# EAGLE schematic EEZ Arduino shield+BP r3B3 (EAGLE 6.1)
Assembly variants: Farnell, TME

## Sheet 1 of 5
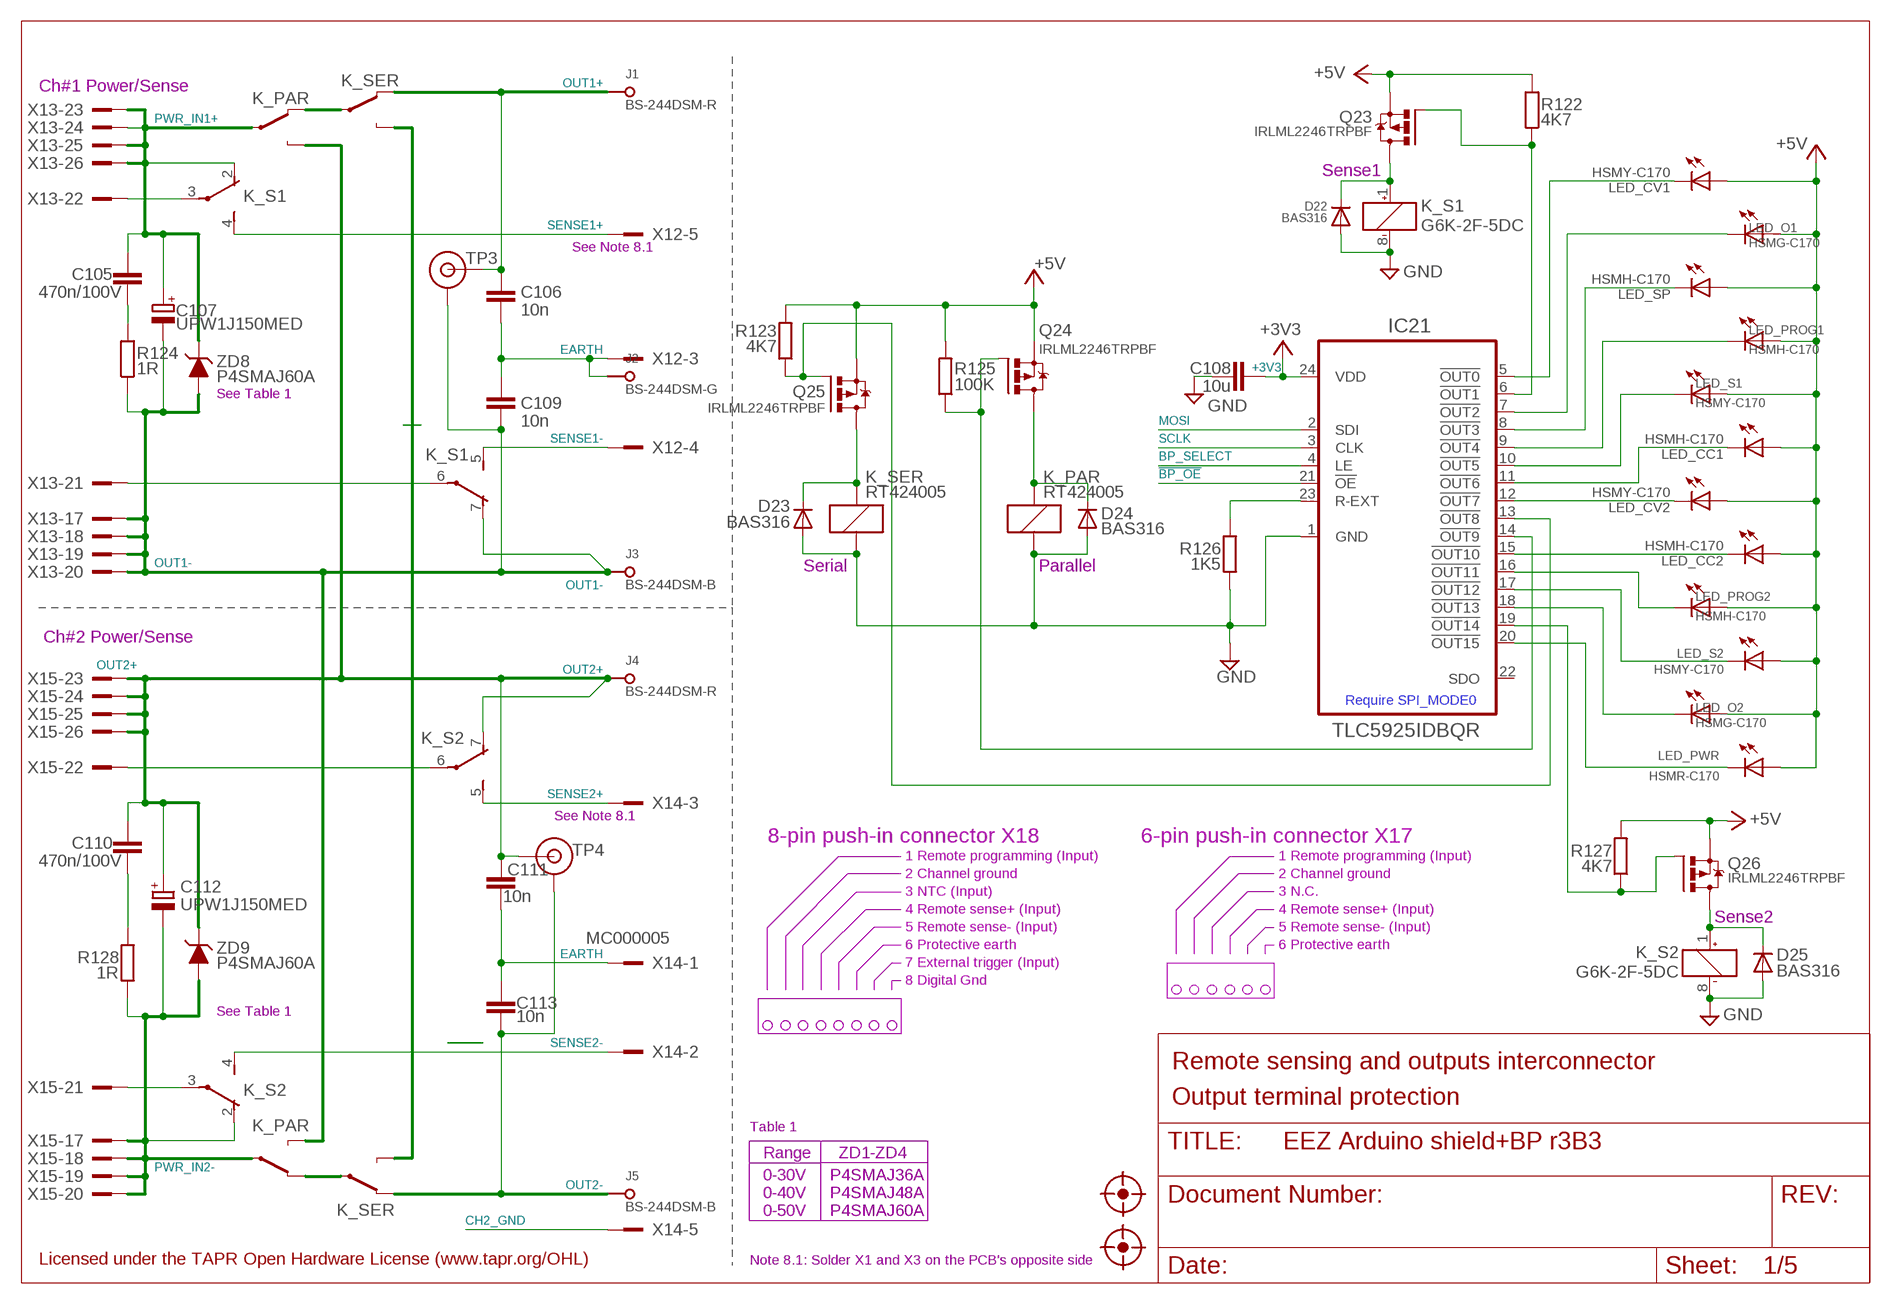
[diagram p0: schematic, sheet 1]

### Parts
C105  470n/100V  C-EUC1812  [C1812]
C106  10n  C-EUC1206  [C1206]
C107  UPW1J150MED  ECAPEEEFK+2.5MM  [CAPAE660X610N_COMBO2]
C108  10u  C-EUC1206  [C1206]
C109  10n  C-EUC1206  [C1206]
C110  470n/100V  C-EUC1812  [C1812]
C111  10n  C-EUC1206  [C1206]
C112  UPW1J150MED  ECAPEEEFK+2.5MM  [CAPAE660X610N_COMBO2]
C113  10n  C-EUC1206  [C1206]
D22  BAS316  DIODE-SOD323-W  [SOD323-W]
D23  BAS316  DIODE-SOD323-W  [SOD323-W]
D24  BAS316  DIODE-SOD323-W  [SOD323-W]
D25  BAS316  DIODE-SOD323-W  [SOD323-W]
IC21  TLC5925IDBQR  [SOP63P600X175-24N]
J1  BS-244DSM-R  BINDING_POST-2  [BP_5_12]
J2  BS-244DSM-G  BINDING_POST-2  [BP_5_12]
J3  BS-244DSM-B  BINDING_POST-2  [BP_5_12]
J4  BS-244DSM-R  BINDING_POST-2  [BP_5_12]
J5  BS-244DSM-B  BINDING_POST-2  [BP_5_12]
K_PAR  RT424005  RELAY_RT314012-2  [RT-C/016A5_ROUND]
K_S1  G6K-2F-5DC  G6K-2F  [G6K-2F]
K_S2  G6K-2F-5DC  G6K-2F  [G6K-2F]
K_SER  RT424005  RELAY_RT314012-2  [RT-C/016A5_ROUND]
LED_CC1  HSMH-C170  LED0805  [LED_0805]
LED_CC2  HSMH-C170  LED0805  [LED_0805]
LED_CV1  HSMY-C170  LED0805  [LED_0805]
LED_CV2  HSMY-C170  LED0805  [LED_0805]
LED_O1  HSMG-C170  LED0805  [LED_0805]
LED_O2  HSMG-C170  LED0805  [LED_0805]
LED_PROG1  HSMH-C170  LED0805  [LED_0805]
LED_PROG2  HSMH-C170  LED0805  [LED_0805]
LED_PWR  HSMR-C170  LED0805  [LED_0805]
LED_S1  HSMY-C170  LED0805  [LED_0805]
LED_S2  HSMY-C170  LED0805  [LED_0805]
LED_SP  HSMH-C170  LED0805  [LED_0805]
Q23  IRLML2246TRPBF  [SOT95P237X112-3N]
Q24  IRLML2246TRPBF  [SOT95P237X112-3N]
Q25  IRLML2246TRPBF  [SOT95P237X112-3N]
Q26  IRLML2246TRPBF  [SOT95P237X112-3N]
R122  4K7  R-EU_R0805  [R0805]
R123  4K7  R-EU_R0805  [R0805]
R124  1R  R-EU_R0805  [R0805]
R125  100K  R-EU_R0805  [R0805]
R126  1K5  R-EU_R0805  [R0805]
R127  4K7  R-EU_R0805  [R0805]
R128  1R  R-EU_R0805  [R0805]
TP3  TEST_POINT  [TP_1.1MM]
TP4  TEST_POINT  [TP_1.1MM]
U$15  FIDUCIAL_2  [FIDUCIAL_DUAL]
U$16  FIDUCIAL_2  [FIDUCIAL_DUAL]
X12  MC000006  MC000006MIRROR  [MC000006_MIRROR]
X13  TSW-113-07-F-D  [TSW-113-07-F-D]
X14  MC000005  MC000005MIRROR  [MC000005_MIRROR]
X15  TSW-113-07-F-D  [TSW-113-07-F-D]
ZD8  P4SMAJ60A  PSMAXX  [DO214AC]
ZD9  P4SMAJ60A  PSMAXX  [DO214AC]

### Nets
!BP_OE: IC21.21(!OE) ; also sheet 2
!BP_OUT0: IC21.5(!OUT0) LED_CV1.C
!BP_OUT1: IC21.6(!OUT1) Q23.1(G) R122.1
!BP_OUT2: IC21.7(!OUT2) LED_O1.C
!BP_OUT3: IC21.8(!OUT3) LED_SP.C
!BP_OUT4: IC21.9(!OUT4) LED_PROG1.C
!BP_OUT5: IC21.10(!OUT5) LED_S1.C
!BP_OUT6: IC21.11(!OUT6) LED_CC1.C
!BP_OUT7: IC21.12(!OUT7) LED_CV2.C
!BP_OUT8: IC21.13(!OUT8) Q25.1(G) R123.1
!BP_OUT9: IC21.14(!OUT9) Q24.1(G) R125.1
!BP_OUT10: IC21.15(!OUT10) LED_CC2.C
!BP_OUT12: IC21.17(!OUT12) LED_S2.C
!BP_OUT13: IC21.18(!OUT13) LED_O2.C
!BP_OUT14: IC21.19(!OUT14) Q26.1(G) R127.1
!BP_OUT15: IC21.20(!OUT15) LED_PWR.C
+3V3: C108.1 IC21.24(VDD) ; also sheet 2,3,4,5
+5V: LED_CC1.A LED_CC2.A LED_CV1.A LED_CV2.A LED_O1.A LED_O2.A LED_PROG1.A LED_PROG2.A LED_PWR.A LED_S1.A LED_S2.A LED_SP.A Q23.2(S) Q24.2(S) Q25.2(S) Q26.2(S) R122.2 R123.2 R125.2 R127.2 ; also sheet 2,3,4,5
BP_SELECT: IC21.4(LE) ; also sheet 2
CH2_GND: X14.5 X14.5.1 ; also sheet 2,4
EARTH: C106.2 C109.1 C111.2 C113.1 J2.P$1 X12.3 X12.3.1 X14.1 X14.1.1 ; also sheet 3
GND [gnd]: C108.2 D22.A D23.A D24.A D25.A IC21.1(GND) K_PAR.A1(K:C2) K_S1.8(1:-) K_S2.8(1:-) K_SER.A1(K:C2) R126.1 ; also sheet 2,3,4,5
MOSI: IC21.2(SDI) ; also sheet 2,3,5
N$92: D22.C K_S1.1(1:+) Q23.3(D)
N$93: D25.C K_S2.1(1:+) Q26.3(D)
N$94: C105.2 R124.2
N$95: C110.2 R128.2
N$96: IC21.16(!OUT11) LED_PROG2.C
N$97: K_SER.14A(-1:O) K_SER.14B(-2:O)
N$98: K_PAR.12A(-1:S) K_SER.11B(-2:P)
N$99: K_PAR.12B(-2:S) K_SER.11A(-1:P)
N$155: D23.C K_SER.A2(K:C1) Q25.3(D)
N$156: D24.C K_PAR.A2(K:C1) Q24.3(D)
N$306: IC21.23(R-EXT) R126.2
OUT1+: C106.1 J1.P$1 K_SER.12B(-2:S) TP3.TIP
OUT1-: C107.2(-) C107.2.1(-) C109.2 J3.P$1 K_PAR.14B(-2:O) K_S1.7(3:O) R124.1 TP3.GND X13.17 X13.18 X13.19 X13.20 ZD8.A
OUT2+: C110.1 C111.1 C112.1(+) C112.1.1(+) J4.P$1 K_PAR.14A(-1:O) K_S2.7(3:O) TP4.TIP X15.23 X15.24 X15.25 X15.26 ZD9.C
OUT2-: C113.2 J5.P$1 K_SER.12A(-1:S) TP4.GND
PWR_IN1+: C105.1 C107.1(+) C107.1.1(+) K_PAR.11A(-1:P) K_S1.2(2:O) X13.23 X13.24 X13.25 X13.26 ZD8.C
PWR_IN2-: C112.2(-) C112.2.1(-) K_PAR.11B(-2:P) K_S2.2(2:O) R128.1 X15.17 X15.18 X15.19 X15.20 ZD9.A
SCLK: IC21.3(CLK) ; also sheet 2,3,5
SENSE1+: K_S1.4(2:S) X12.5 X12.5.1
SENSE1-: K_S1.5(3:S) X12.4 X12.4.1
SENSE1_IN+: K_S1.3(2:P) X13.22
SENSE1_IN-: K_S1.6(3:P) X13.21
SENSE2+: K_S2.5(3:S) X14.3 X14.3.1
SENSE2-: K_S2.4(2:S) X14.2 X14.2.1
SENSE2_IN+: K_S2.6(3:P) X15.22
SENSE2_IN-: K_S2.3(2:P) X15.21
Unconnected: IC21.22(SDO) X14.4 X14.4.1

### Notes on the sheet
- Ch#1 Power/Sense
- Sense1
- See Note 8.1
- See Table 1
- Serial | Parallel
- Ch#2 Power/Sense
- Require SPI_MODE0
- See Note 8.1
- 8-pin push-in connector X18 | 6-pin push-in connector X17
- 1 Remote programming (Input) | 1 Remote programming (Input)
- 2 Channel ground | 2 Channel ground
- 3 NTC (Input) | 3 N.C.
- 4 Remote sense+ (Input) | 4 Remote sense+ (Input)
- Sense2
- 5 Remote sense- (Input) | 5 Remote sense- (Input)
- 6 Protective earth | 6 Protective earth
- 7 External trigger (Input)
- 8 Digital Gnd
- See Table 1
- Remote sensing and outputs interconnector
- Output terminal protection
- Table 1
- Range | ZD1-ZD4
- 0-30V | P4SMAJ36A
- 0-40V | P4SMAJ48A
- 0-50V | P4SMAJ60A
- Licensed under the TAPR Open Hardware License (www.tapr.org/OHL) | Note 8.1: Solder X1 and X3 on the PCB's opposite side

## Sheet 2 of 5
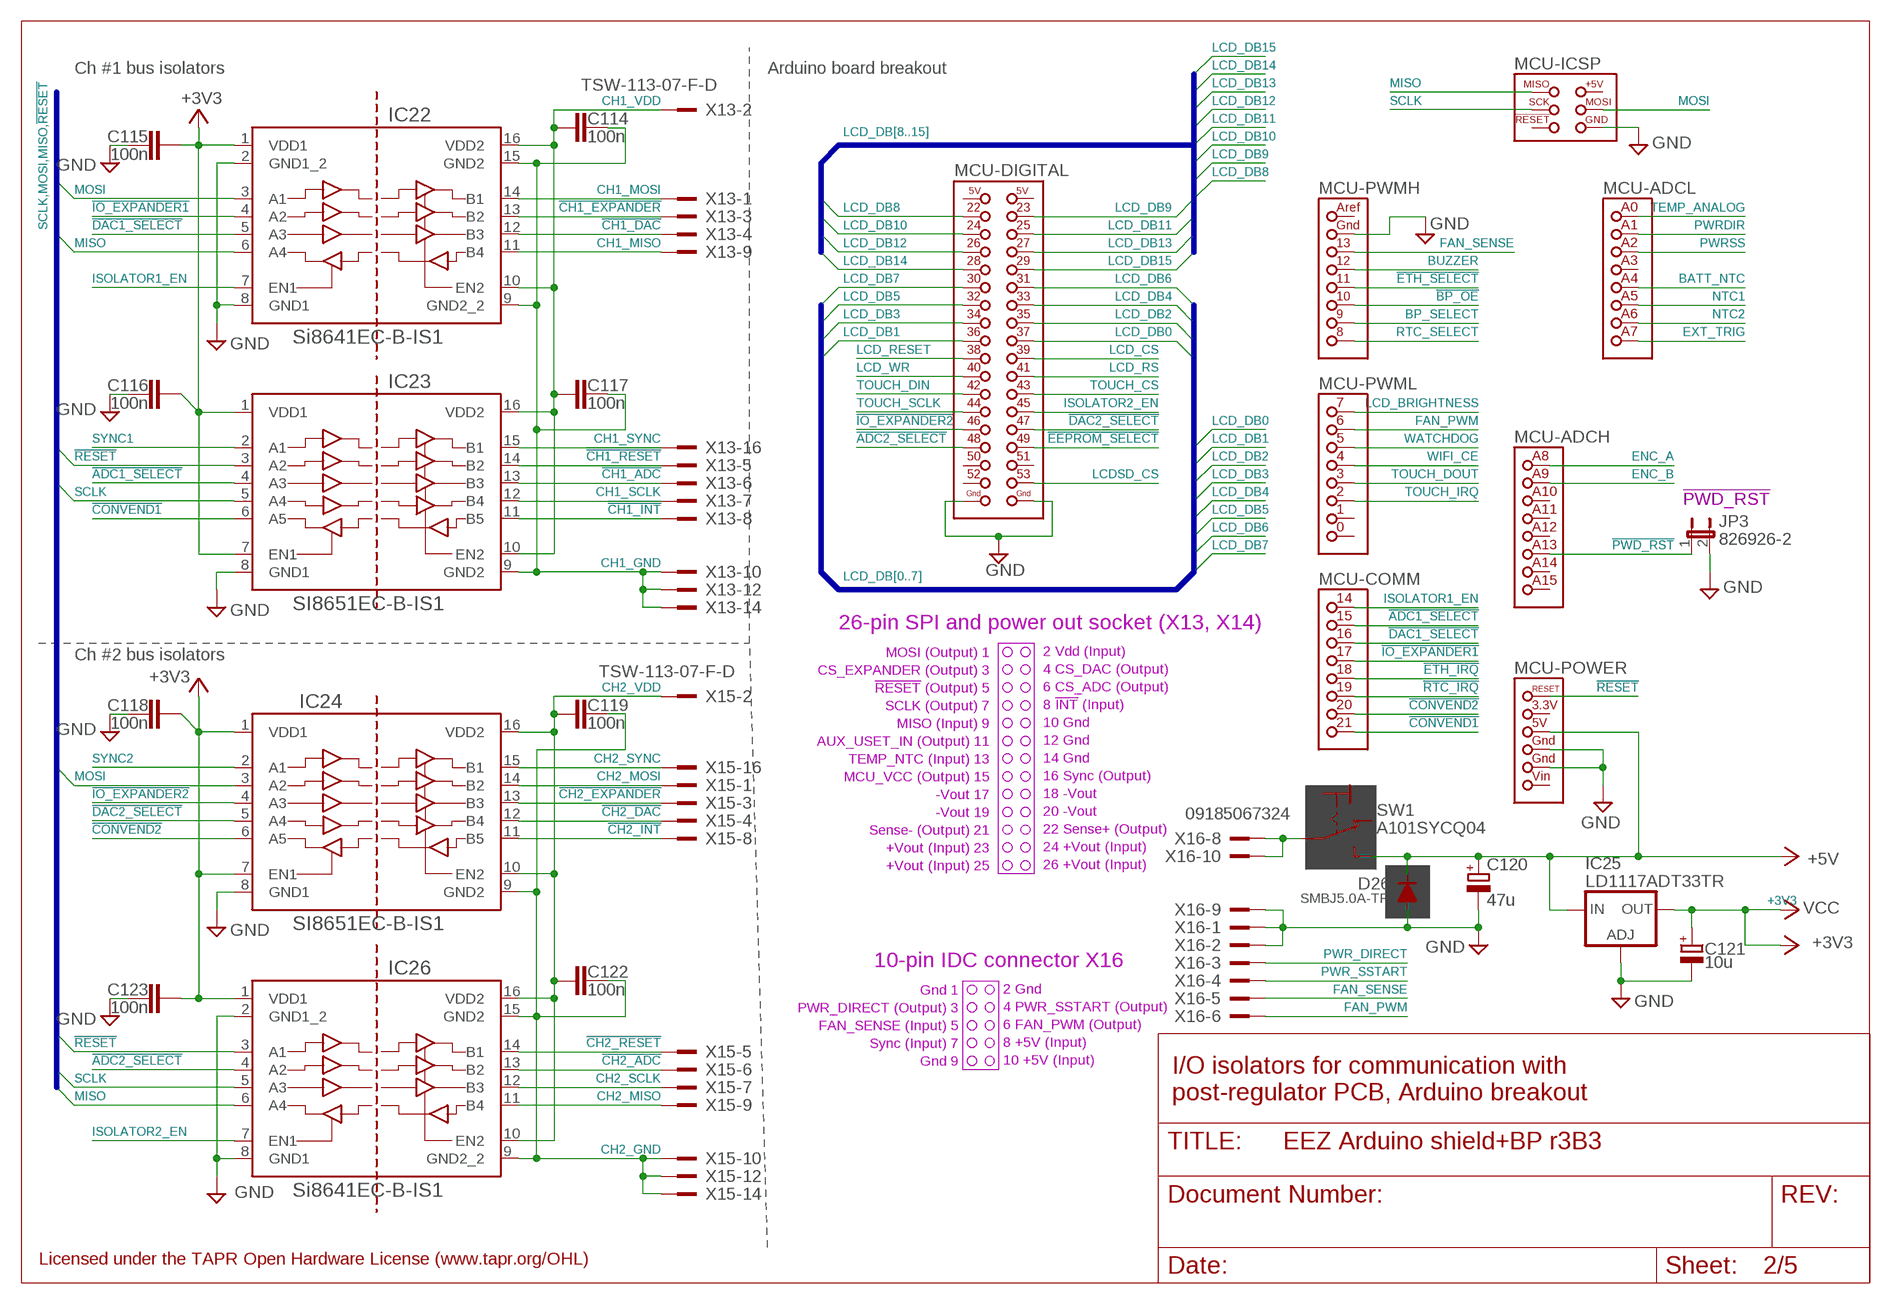
[diagram p1: schematic, sheet 2]

### Parts
C114  100n  C-EUC0603  [C0603]
C115  100n  C-EUC0603  [C0603]
C116  100n  C-EUC0603  [C0603]
C117  100n  C-EUC0603  [C0603]
C118  100n  C-EUC0603  [C0603]
C119  100n  C-EUC0603  [C0603]
C120  47u  ECAPPANASONIC_C  [PANASONIC_C]
C121  10u  ECAPPANASONIC_C  [PANASONIC_C]
C122  100n  C-EUC0603  [C0603]
C123  100n  C-EUC0603  [C0603]
D26  SMBJ5.0A-TR  DIODEDO214AA  [DO214AA]
IC22  Si8641EC-B-IS1  SI8641NSOIC-16  [SOIC-16]
IC23  SI8651EC-B-IS1  SI8651NSOIC-16  [SOIC-16]
IC24  SI8651EC-B-IS1  SI8651NSOIC-16  [SOIC-16]
IC25  LD1117ADT33TR  LD117ADT33TR  [DPACK]
IC26  Si8641EC-B-IS1  SI8641NSOIC-16  [SOIC-16]
JP3  826926-2  JP1E  [JP1]
MCU  Arduino Due  ARDUINO_MEGA+ICSPMIRROR  [ARDUINO+ICSP_MIRROR]
SW1  A101SYCQ04  M9040P  [M9040P]
X16  09185067324  IDC-10PINBLACK  [IDC-10PIN]

### Nets
!ADC1_SELECT: IC23.4(A3) MCU.15
!ADC2_SELECT: IC26.4(A2) MCU.48(-DIGITAL:48(PL3))
!BP_OE: MCU.10 ; also sheet 1
!CH1_ADC: IC23.13(B3) X13.6
!CH1_DAC: IC22.12(B3) X13.4
!CH1_EXPANDER: IC22.13(B2) X13.3
!CH1_INT: IC23.11(B5) X13.8
!CH1_RESET: IC23.14(B2) X13.5
!CH2_ADC: IC26.13(B2) X15.6
!CH2_DAC: IC24.12(B4) X15.4
!CH2_EXPANDER: IC24.13(B3) X15.3
!CH2_INT: IC24.11(B5) X15.8
!CH2_RESET: IC26.14(B1) X15.5
!CONVEND1: IC23.6(A5) MCU.21
!CONVEND2: IC24.6(A5) MCU.20
!DAC1_SELECT: IC22.5(A3) MCU.16
!DAC2_SELECT: IC24.5(A4) MCU.47(-DIGITAL:47(PL4))
!EEPROM_SELECT: MCU.49(-DIGITAL:49(PL2)) ; also sheet 3
!ETH_IRQ: MCU.18 ; also sheet 3,5
!ETH_SELECT: MCU.11 ; also sheet 3,5
!IO_EXPANDER1: IC22.4(A2) MCU.17
!IO_EXPANDER2: IC24.4(A3) MCU.46(-DIGITAL:46(PL5))
!PWD_RST: JP3.1 MCU.A13(-ADCH:ADC13)
!RESET: IC23.3(A2) IC26.3(A1) MCU.RESET(-POWER:!RESET) ; also sheet 3,4,5
!RTC_IRQ: MCU.19 ; also sheet 3
+3V3: C115.1 C116.1 C118.1 C121.1(+) C123.1 IC22.1(VDD1) IC23.1(VDD1) IC23.7(EN1) IC24.1(VDD1) IC24.7(EN1) IC25.4(OUT) IC26.1(VDD1) ; supply symbol labelled VCC ; also sheet 1,3,4,5
+5V: C120.1(+) D26.C IC25.3(IN) MCU.5V(-POWER:5V) SW1.3(S) ; also sheet 1,3,4,5
BATT_NTC: MCU.A4(-ADCL:ADC4) ; also sheet 4
BP_SELECT: MCU.9(-PWMH:9(PH6)) ; also sheet 1
BUZZER: MCU.12 ; also sheet 3
CH1_GND: C114.2 C117.2 IC22.9(GND2_2) IC22.15(GND2) IC23.9(GND2) X13.10 X13.12 X13.14 ; also sheet 4
CH1_MISO: IC22.11(B4) X13.9
CH1_MOSI: IC22.14(B1) X13.1
CH1_SCLK: IC23.12(B4) X13.7
CH1_SYNC: IC23.15(B1) X13.16
CH1_VDD: C114.1 C117.1 IC22.10(EN2) IC22.16(VDD2) IC23.10(EN2) IC23.16(VDD2) X13.2 ; also sheet 4
CH2_GND: C119.2 C122.2 IC24.9(GND2) IC26.9(GND2_2) IC26.15(GND2) X15.10 X15.12 X15.14 ; also sheet 1,4
CH2_MISO: IC26.11(B4) X15.9
CH2_MOSI: IC24.14(B2) X15.1
CH2_SCLK: IC26.12(B3) X15.7
CH2_SYNC: IC24.15(B1) X15.16
CH2_VDD: C119.1 C122.1 IC24.10(EN2) IC24.16(VDD2) IC26.10(EN2) IC26.16(VDD2) X15.2
ENC_A: MCU.A8(-ADCH:ADC8) ; also sheet 5
ENC_B: MCU.A9(-ADCH:ADC9) ; also sheet 5
EXT_TRIG: MCU.A7(-ADCL:ADC7) ; also sheet 4
FAN_PWM: MCU.6(-PWML:6(PH3)) X16.6
FAN_SENSE: MCU.13 X16.5
GND [gnd]: C115.2 C116.2 C118.2 C120.2(-) C121.2(-) C123.2 D26.A IC22.2(GND1_2) IC22.8(GND1) IC23.8(GND1) IC24.8(GND1) IC25.1(ADJ) IC26.2(GND1_2) IC26.8(GND1) JP3.2 MCU.GND1(-POWER:GND1) MCU.GND2(-POWER:GND2) MCU.GND3(-DIGITAL:GND3) MCU.GND4(-DIGITAL:GND4) MCU.GND(-PWMH:GND) MCU.ICSP_GND(-ICSP:GND) X16.1 X16.2 X16.9 ; also sheet 1,3,4,5
ISOLATOR1_EN: IC22.7(EN1) MCU.14
ISOLATOR2_EN: IC26.7(EN1) MCU.45(-DIGITAL:45(PL6))
LCD_BRIGHTNESS: MCU.7(-PWML:7(PH4)) ; also sheet 3
LCD_CS: MCU.39(-DIGITAL:39(PC0)) ; also sheet 3
LCD_DB0: MCU.37(-DIGITAL:37(PC2)) ; also sheet 3
LCD_DB1: MCU.36(-DIGITAL:36(PC3)) ; also sheet 3
LCD_DB2: MCU.35(-DIGITAL:35(PC4)) ; also sheet 3
LCD_DB3: MCU.34(-DIGITAL:34(PC5)) ; also sheet 3
LCD_DB4: MCU.33(-DIGITAL:33(PC6)) ; also sheet 3
LCD_DB5: MCU.32(-DIGITAL:32(PC7)) ; also sheet 3
LCD_DB6: MCU.31(-DIGITAL:31(PA7)) ; also sheet 3
LCD_DB7: MCU.30(-DIGITAL:30(PA6)) ; also sheet 3
LCD_DB8: MCU.22 ; also sheet 3
LCD_DB9: MCU.23 ; also sheet 3
LCD_DB10: MCU.24(-DIGITAL:24(PA0)) ; also sheet 3
LCD_DB11: MCU.25(-DIGITAL:25(PA1)) ; also sheet 3
LCD_DB12: MCU.26(-DIGITAL:26(PA2)) ; also sheet 3
LCD_DB13: MCU.27(-DIGITAL:27(PA3)) ; also sheet 3
LCD_DB14: MCU.28(-DIGITAL:28(PA4)) ; also sheet 3
LCD_DB15: MCU.29(-DIGITAL:29(PA5)) ; also sheet 3
LCD_RESET: MCU.38(-DIGITAL:38(PC1)) ; also sheet 3
LCD_RS: MCU.41(-DIGITAL:41(PG2)) ; also sheet 3
LCD_WR: MCU.40(-DIGITAL:40(PD7)) ; also sheet 3
LCDSD_CS: MCU.53(-DIGITAL:53(PB2/MOSI)) ; also sheet 3
MISO: IC22.6(A4) IC26.6(A4) MCU.ICSP_MISO(-ICSP:MISO) ; also sheet 3,5
MOSI: IC22.3(A1) IC24.3(A2) MCU.ICSP_MOSI(-ICSP:MOSI) ; also sheet 1,3,5
N$100: SW1.2(P) X16.8 X16.10
NTC1: MCU.A5(-ADCL:ADC5) ; also sheet 3
NTC2: MCU.A6(-ADCL:ADC6) ; also sheet 3
PWR_DIRECT: X16.3 ; also sheet 4
PWR_SSTART: X16.4 ; also sheet 4
PWRDIR: MCU.A1(-ADCL:ADC1) ; also sheet 4
PWRSS: MCU.A2(-ADCL:ADC2) ; also sheet 4
RTC_SELECT: MCU.8(-PWMH:8(PH5)) ; also sheet 3
SCLK: IC23.5(A4) IC26.5(A3) MCU.ICSP_SCK(-ICSP:SCK) ; also sheet 1,3,5
SYNC1: IC23.2(A1) ; also sheet 5
SYNC2: IC24.2(A1) ; also sheet 5
TEMP_ANALOG: MCU.A0(-ADCL:ADC0) ; also sheet 3
TOUCH_CS: MCU.43(-DIGITAL:43(PG0)) ; also sheet 3
TOUCH_DIN: MCU.42(-DIGITAL:42(PG1)) ; also sheet 3
TOUCH_DOUT: MCU.3(-PWML:3(PE5)) ; also sheet 3
TOUCH_IRQ: MCU.2(-PWML:2(PE4)) ; also sheet 3
TOUCH_SCLK: MCU.44(-DIGITAL:44(PL7)) ; also sheet 3
WATCHDOG: MCU.5(-PWML:5(PE3)) ; also sheet 4
WIFI_CE: MCU.4(-PWML:4(PG5)) ; also sheet 5
Unconnected: MCU.0(-PWML:0(PE0)) MCU.1(-PWML:1(PE1)) MCU.3.3V(-POWER:3V3) MCU.5V(1)(-DIGITAL:5V(1)) MCU.5V(2)(-DIGITAL:5V(2)) MCU.50(-DIGITAL:50(PL1/MISO)) MCU.51(-DIGITAL:51(PL0)) MCU.52(-DIGITAL:52(PB3/SCK)) MCU.A3(-ADCL:ADC3) MCU.A10(-ADCH:ADC10) MCU.A11(-ADCH:ADC11) MCU.A12(-ADCH:ADC12) MCU.A14(-ADCH:ADC14) MCU.A15(-ADCH:ADC15) MCU.AREF(-PWMH:AREF) MCU.ICSP_+5V(-ICSP:+5V) MCU.ICSP_RESET(-ICSP:!RESET) MCU.VIN(-POWER:VIN) SW1.1(O)

### Buses
SCLK,MOSI,MISO,!RESET
LCD_DB[8..15]
LCD_DB[0..7]

### Notes on the sheet
- Ch #1 bus isolators | Arduino board breakout
- !PWD_RST
- 26-pin SPI and power out socket (X13, X14)
- MOSI (Output) 1
- 2 Vdd (Input)
- Ch #2 bus isolators
- CS_EXPANDER (Output) 3
- 4 CS_DAC (Output)
- !RESET! (Output) 5
- 6 CS_ADC (Output)
- SCLK (Output) 7
- 8 !INT! (Input)
- MISO (Input) 9
- 10 Gnd
- AUX_USET_IN (Output) 11
- 12 Gnd
- TEMP_NTC (Input) 13
- 14 Gnd
- MCU_VCC (Output) 15
- 16 Sync (Output)
- -Vout 17
- 18 -Vout
- -Vout 19
- 20 -Vout
- Sense- (Output) 21
- 22 Sense+ (Output)
- +Vout (Input) 23
- 24 +Vout (Input)
- +Vout (Input) 25
- 26 +Vout (Input)
- 10-pin IDC connector X16
- Gnd 1
- 2 Gnd
- PWR_DIRECT (Output) 3
- 4 PWR_SSTART (Output)
- FAN_SENSE (Input) 5
- 6 FAN_PWM (Output)
- Sync (Input) 7
- 8 +5V (Input)
- Gnd 9
- 10 +5V (Input)
- I/O isolators for communication with
- post-regulator PCB, Arduino breakout
- Licensed under the TAPR Open Hardware License (www.tapr.org/OHL)

## Sheet 3 of 5
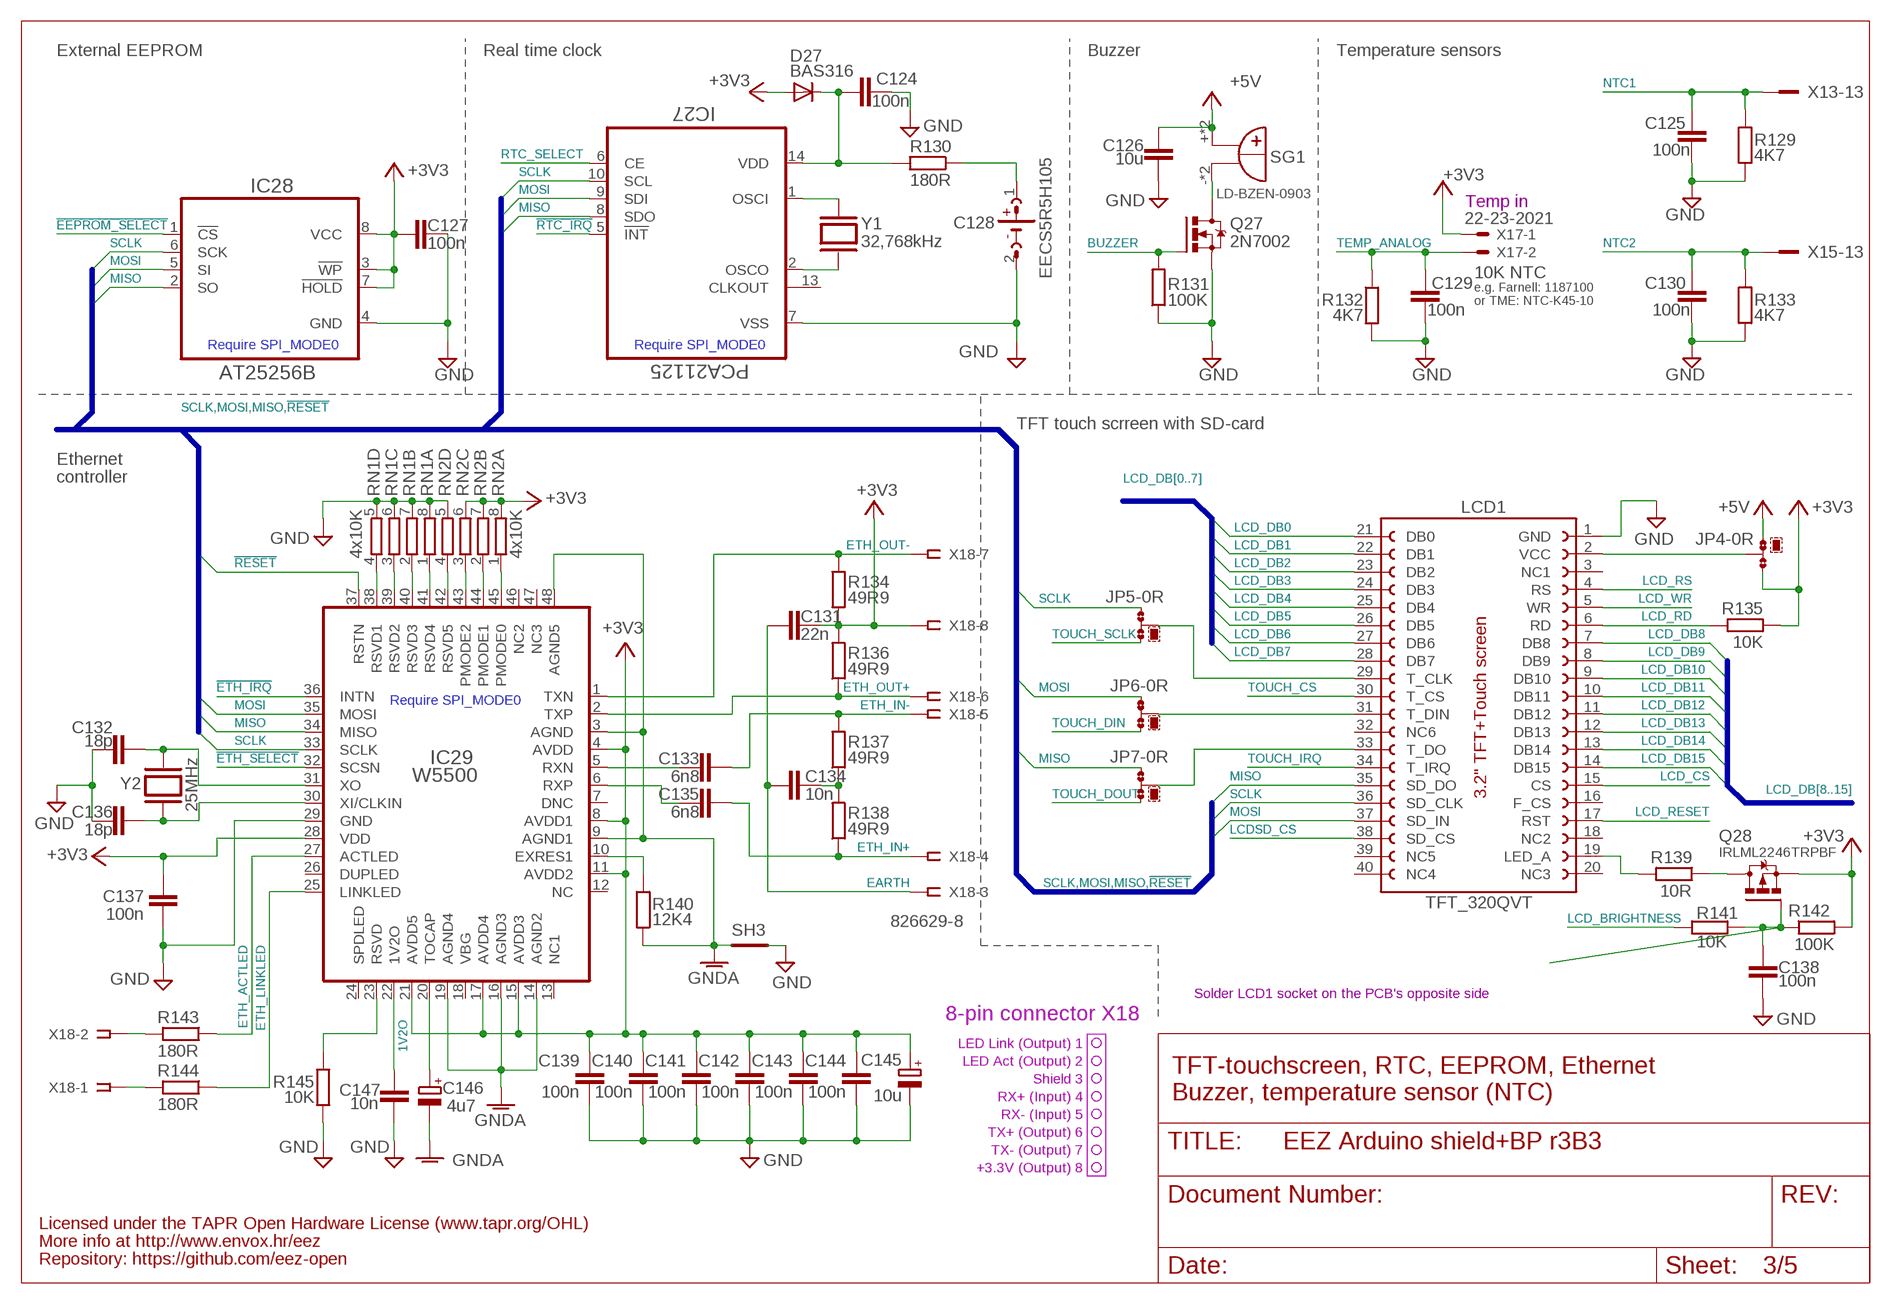
[diagram p2: schematic, sheet 3]

### Parts
C124  100n  C-EUC0603  [C0603]
C125  100n  C-EUC0603  [C0603]
C126  10u  C-EUC1206  [C1206]
C127  100n  C-EUC0603  [C0603]
C128  EECS5R5H105  SUPER_CAP  [SG-R20MM]
C129  100n  C-EUC0603  [C0603]
C130  100n  C-EUC0603  [C0603]
C131  22n  C-EUC0805  [C0805]
C132  18p  C-EUC0805  [C0805]
C133  6n8  C-EUC0603  [C0603]
C134  10n  C-EUC0805  [C0805]
C135  6n8  C-EUC0603  [C0603]
C136  18p  C-EUC0805  [C0805]
C137  100n  C-EUC0603  [C0603]
C138  100n  C-EUC0603  [C0603]
C139  100n  C-EUC0603  [C0603]
C140  100n  C-EUC0603  [C0603]
C141  100n  C-EUC0603  [C0603]
C142  100n  C-EUC0603  [C0603]
C143  100n  C-EUC0603  [C0603]
C144  100n  C-EUC0603  [C0603]
C145  10u  ECAP1206  [EC1206]
C146  4u7  ECAP1206  [EC1206]
C147  10n  C-EUC0805  [C0805]
D27  BAS316  DIODE-SOD323-W  [SOD323-W]
IC27  PCA21125  PCA21125TSSOP-14  [SOP65P640X120-14N]
IC28  AT25256B  AT25XXXSOIC8  [SOIC127P600X175-8N]
IC29  W5500  [TQFP48-7X7]
JP4  0R-JUMPA  [A0R-JMP]
JP5  0R-JUMPA  [A0R-JMP]
JP6  0R-JUMPA  [A0R-JMP]
JP7  0R-JUMPA  [A0R-JMP]
LCD1  TFT_320QVT  LCD_TFT_320QVTMIRROR  [LCD_TFT_320QVT_MIRROR]
Q27  2N7002  [SOT103P240X110-3N]
Q28  IRLML2246TRPBF  [SOT95P237X112-3N]
R129  4K7  R-EU_R0805  [R0805]
R130  180R  R-EU_R0805  [R0805]
R131  100K  R-EU_R0805  [R0805]
R132  4K7  R-EU_R0805  [R0805]
R133  4K7  R-EU_R0805  [R0805]
R134  49R9  R-EU_R0805  [R0805]
R135  10K  R-EU_R0805  [R0805]
R136  49R9  R-EU_R0805  [R0805]
R137  49R9  R-EU_R0805  [R0805]
R138  49R9  R-EU_R0805  [R0805]
R139  10R  R-EU_R0805  [R0805]
R140  12K4  R-EU_R0805  [R0805]
R141  10K  R-EU_R0805  [R0805]
R142  100K  R-EU_R0805  [R0805]
R143  180R  R-EU_R0805  [R0805]
R144  180R  R-EU_R0805  [R0805]
R145  10K  R-EU_R0805  [R0805]
RN1  4x10K  R_ARRAY4  [CAY16]
RN2  4x10K  R_ARRAY4  [CAY16]
SG1  LD-BZEN-0903  BUZZER  [BUZZER]
SH3  SHORTNOHOLE  [SHORT_NOHOLE]
X17  22-23-2021  [22-23-2021]
X18  826629-8  SSW-108-02-S-S  [SSW-108-02-S-S]
Y1  32,768kHz  XTALR26  [R26_XTAL]
Y2  25MHz  XTALSMD  [HC-49/4H]

### Nets
1V2O: C147.2 IC29.22(1V2O)
!EEPROM_SELECT: IC28.1(!CS) ; also sheet 2
!ETH_IRQ: IC29.36(INTN) ; also sheet 2,5
!ETH_SELECT: IC29.32(SCSN) ; also sheet 2,5
!RESET: IC29.37(RSTN) ; also sheet 2,4,5
!RTC_IRQ: IC27.5(!INT) ; also sheet 2
+3V3: C127.1 C131.1 C137.2 C139.1 C140.1 C141.1 C142.1 C143.1 C144.1 C145.+ D27.A IC28.3(!WP) IC28.7(!HOLD) IC28.8(VCC) IC29.4(AVDD) IC29.8(AVDD1) IC29.11(AVDD2) IC29.15(AVDD3) IC29.17(AVDD4) IC29.21(AVDD5) IC29.28(VDD) JP4.3 Q28.2(S) R134.1 R135.2 R136.2 R142.2 RN2.6 RN2.7 RN2.8 X17.1 X18.8 ; also sheet 1,2,4,5
+5V: C126.2 JP4.1 SG1.+ SG1.+B(+) ; also sheet 1,2,4,5
BUZZER: Q27.1(G) R131.2 ; also sheet 2
EARTH: C131.2 C134.2 X18.3 ; also sheet 1
ETH_ACTLED: IC29.27(ACTLED) R143.1
ETH_IN+: C135.1 R138.1 X18.4
ETH_IN-: C133.1 R137.2 X18.5
ETH_LINKLED: IC29.25(LINKLED) R144.1
ETH_OUT+: IC29.2(TXP) R136.1 X18.6
ETH_OUT-: IC29.1(TXN) R134.2 X18.7
GND [gnd]: C124.1 C125.1 C126.1 C127.2 C128.2(-) C129.1 C130.1 C132.2 C136.2 C137.1 C138.1 C139.2 C140.2 C141.2 C142.2 C143.2 C144.2 C145.- C147.1 IC27.7(VSS) IC28.4(GND) IC29.29(GND) LCD1.1(GND) Q27.2(S) R129.2 R131.1 R132.2 R133.2 R145.1 RN1.5 RN1.6 RN1.7 RN1.8 RN2.5 SH3.P$1(GND_A) ; also sheet 1,2,4,5
GNDA [gnd]: C146.- IC29.3(AGND) IC29.9(AGND1) IC29.14(AGND2) IC29.16(AGND3) IC29.19(AGND4) IC29.48(AGND5) R140.1 SH3.P$2(GND_B)
LCD_BRIGHTNESS: R141.1 ; also sheet 2
LCD_CS: LCD1.15(CS) ; also sheet 2
LCD_DB0: LCD1.21(DB0) ; also sheet 2
LCD_DB1: LCD1.22(DB1) ; also sheet 2
LCD_DB2: LCD1.23(DB2) ; also sheet 2
LCD_DB3: LCD1.24(DB3) ; also sheet 2
LCD_DB4: LCD1.25(DB4) ; also sheet 2
LCD_DB5: LCD1.26(DB5) ; also sheet 2
LCD_DB6: LCD1.27(DB6) ; also sheet 2
LCD_DB7: LCD1.28(DB7) ; also sheet 2
LCD_DB8: LCD1.7(DB8) ; also sheet 2
LCD_DB9: LCD1.8(DB9) ; also sheet 2
LCD_DB10: LCD1.9(DB10) ; also sheet 2
LCD_DB11: LCD1.10(DB11) ; also sheet 2
LCD_DB12: LCD1.11(DB12) ; also sheet 2
LCD_DB13: LCD1.12(DB13) ; also sheet 2
LCD_DB14: LCD1.13(DB14) ; also sheet 2
LCD_DB15: LCD1.14(DB15) ; also sheet 2
LCD_RD: LCD1.6(RD) R135.1
LCD_RESET: LCD1.17(RST) ; also sheet 2
LCD_RS: LCD1.4(RS) ; also sheet 2
LCD_WR: LCD1.5(WR) ; also sheet 2
LCDSD_CS: LCD1.38(SD_CS) ; also sheet 2
LED_A: LCD1.19(LED_A) R139.2
MISO: IC27.8(SDO) IC28.2(SO) IC29.34(MISO) JP7.1 LCD1.35(SD_DO) ; also sheet 2,5
MOSI: IC27.9(SDI) IC28.5(SI) IC29.35(MOSI) JP6.1 LCD1.37(SD_IN) ; also sheet 1,2,5
N$101: Q27.3(D) SG1.- SG1.-B(-)
N$102: JP4.2 LCD1.2(VCC)
N$103: Q28.3(D) R139.1
N$104: JP7.2 LCD1.33(T_DO)
N$105: JP5.2 LCD1.29(T_CLK)
N$106: JP6.2 LCD1.31(T_DIN)
N$107: C128.1(+) R130.1
N$108: IC29.23(RSVD) R145.2
N$109: C124.2 D27.C IC27.14(VDD) R130.2
N$110: IC29.10(EXRES1) R140.2
N$111: C132.1 IC29.31(XO) Y2.1
N$112: C136.1 IC29.30(XI/CLKIN) Y2.2
N$113: C133.2 IC29.5(RXN)
N$115: C135.2 IC29.6(RXP)
N$116: R144.2 X18.1
N$118: R143.2 X18.2
N$119: IC29.43(PMODE2) RN2.3
N$120: IC29.44(PMODE1) RN2.2
N$121: IC29.45(PMODE0) RN2.1
N$122: IC29.42(RSVD5) RN2.4
N$123: IC29.38(RSVD1) RN1.4
N$124: C134.1 R137.1 R138.2
N$126: IC29.39(RSVD2) RN1.3
N$127: IC29.41(RSVD4) RN1.1
N$130: IC29.40(RSVD3) RN1.2
N$132: C138.2 Q28.1(G) R141.2 R142.1
N$133: IC27.1(OSCI) Y1.2
N$134: IC27.2(OSCO) Y1.1
NTC1: C125.2 R129.1 X13.13 ; also sheet 2
NTC2: C130.2 R133.1 X15.13 ; also sheet 2
RTC_SELECT: IC27.6(CE) ; also sheet 2
SCLK: IC27.10(SCL) IC28.6(SCK) IC29.33(SCLK) JP5.1 LCD1.36(SD_CLK) ; also sheet 1,2,5
TEMP_ANALOG: C129.2 R132.1 X17.2 ; also sheet 2
TOCAP: C146.+ IC29.20(TOCAP)
TOUCH_CS: LCD1.30(T_CS) ; also sheet 2
TOUCH_DIN: JP6.3 ; also sheet 2
TOUCH_DOUT: JP7.3 ; also sheet 2
TOUCH_IRQ: LCD1.34(T_IRQ) ; also sheet 2
TOUCH_SCLK: JP5.3 ; also sheet 2
Unconnected: IC27.13(CLKOUT) IC29.7(DNC) IC29.12(NC) IC29.13(NC1) IC29.18(VBG) IC29.24(SPDLED) IC29.26(DUPLED) IC29.46(NC2) IC29.47(NC3) LCD1.3(NC1) LCD1.16(F_CS) LCD1.18(NC2) LCD1.20(NC3) LCD1.32(NC6) LCD1.39(NC5) LCD1.40(NC4)

### Buses
SCLK,MOSI,MISO,!RESET
LCD_DB[0..7]
LCD_DB[8..15]

### Notes on the sheet
- External EEPROM | Real time clock | Buzzer | Temperature sensors
- Temp in
- 10K NTC
- e.g. Farnell: 1187100
- or TME: NTC-K45-10
- Require SPI_MODE0 | Require SPI_MODE0
- TFT touch scrreen with SD-card
- Ethernet
- controller
- Require SPI_MODE0
- Solder LCD1 socket on the PCB's opposite side
- 8-pin connector X18
- LED Link (Output) 1
- LED Act (Output) 2
- Shield 3 | TFT-touchscreen, RTC, EEPROM, Ethernet
- RX+ (Input) 4
- Buzzer, temperature sensor (NTC)
- RX- (Input) 5
- TX+ (Output) 6
- TX- (Output) 7
- +3.3V (Output) 8
- Licensed under the TAPR Open Hardware License (www.tapr.org/OHL)
- More info at http://www.envox.hr/eez
- Repository: https://github.com/eez-open

## Sheet 4 of 5
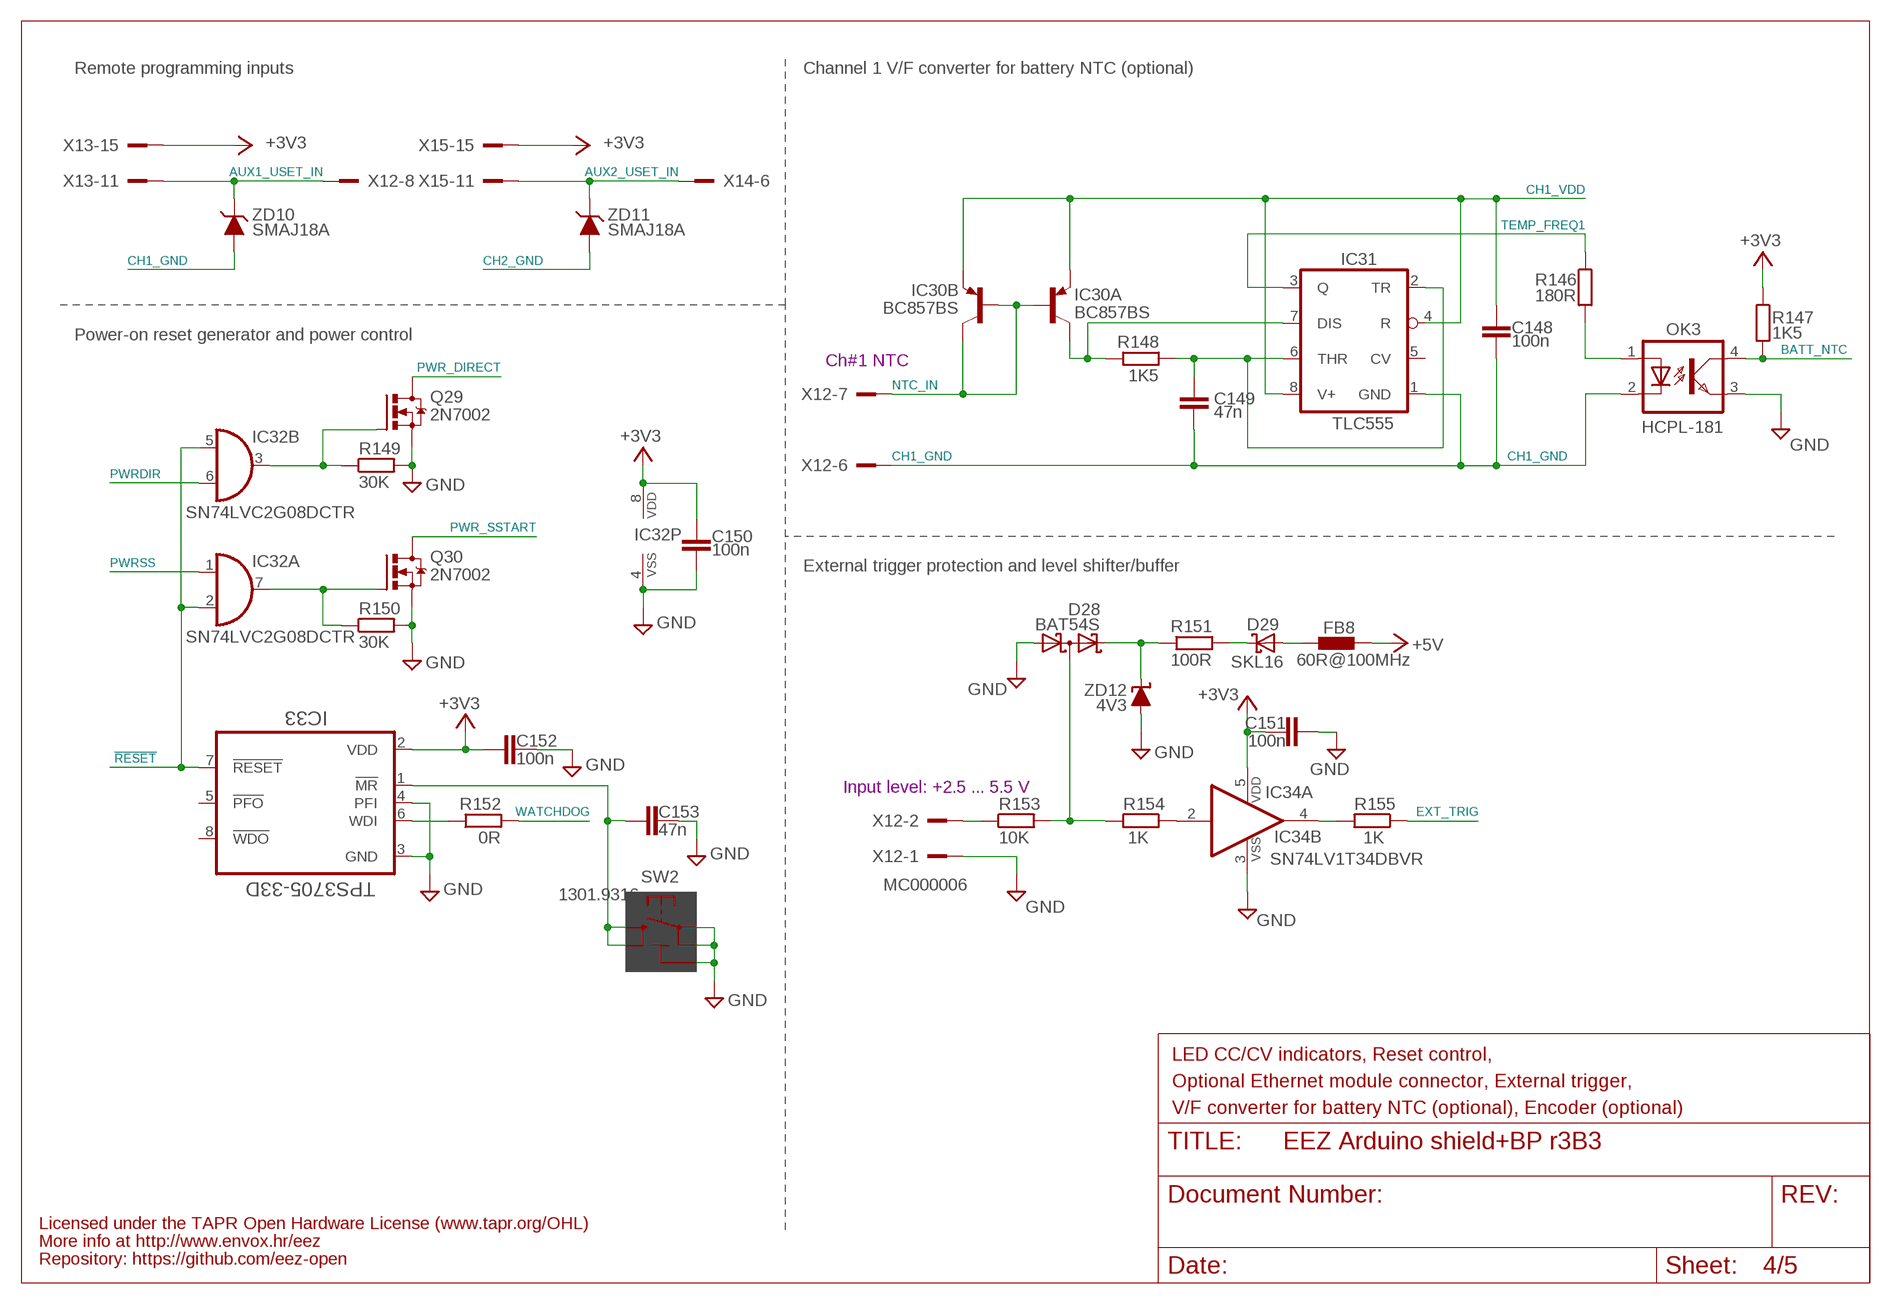
[diagram p3: schematic, sheet 4]

### Parts
C148  100n  C-EUC0603  [C0603]
C149  47n  C-EUC0805  [C0805]
C150  100n  C-EUC0603  [C0603]
C151  100n  C-EUC0603  [C0603]
C152  100n  C-EUC0603  [C0603]
C153  47n  C-EUC0805  [C0805]
D28  BAT54S  [SOT23]
D29  SKL16  SCHOTTKYSOD123  [SOD123]
FB8  60R@100MHz  FERRITE_BEAD0603  [BEAD0603]
IC30  BC857BS  [SOT65P210X110-6N]
IC31  TLC555  LM555SOIC8  [SOIC127P600X175-8N]
IC32  SN74LVC2G08DCTR  [SOP65P400X130-8N]
IC33  TPS3705-33D  TPS3705XX  [SOIC127P600X175-8N]
IC34  SN74LV1T34DBVR  SN74LV1T34  [SOT95P280X145-5N]
OK3  HCPL-181  [HCPL-181]
Q29  2N7002  [SOT103P240X110-3N]
Q30  2N7002  [SOT103P240X110-3N]
R146  180R  R-EU_R0805  [R0805]
R147  1K5  R-EU_R0805  [R0805]
R148  1K5  R-EU_R0805  [R0805]
R149  30K  R-EU_R0805  [R0805]
R150  30K  R-EU_R0805  [R0805]
R151  100R  R-EU_R0805  [R0805]
R152  0R  R-EU_R0805  [R0805]
R153  10K  R-EU_R1206  [R1206]
R154  1K  R-EU_R0805  [R0805]
R155  1K  R-EU_R0805  [R0805]
SW2  1301.9316  TACT_SW  [TACTM-6XN]
ZD10  SMAJ18A  PSMAXX  [DO214AC]
ZD11  SMAJ18A  PSMAXX  [DO214AC]
ZD12  4V3  ZENER-DIODEMINIMELF  [MINIMELF]

### Nets
!MR: C153.2 IC33.1(!MR) SW2.3 SW2.4
!RESET: IC32.2(A:I1) IC32.5(B:I0) IC33.7(!RESET) ; also sheet 2,3,5
+3V3: C150.2 C151.1 C152.2 IC32.8(P:VDD) IC33.2(VDD) IC34.5(B:VDD) R147.1 X13.15 X15.15 ; also sheet 1,2,3,5
+5V: FB8.P$1 ; also sheet 1,2,3,5
AUX1_USET_IN: X12.8 X12.8.1 X13.11 ZD10.C
AUX2_USET_IN: X14.6 X14.6.1 X15.11 ZD11.C
BATT_NTC: OK3.4(COL) R147.2 ; also sheet 2
CH1_GND: C148.2 C149.1 IC31.1(GND) OK3.2(C) X12.6 X12.6.1 ZD10.A ; also sheet 2
CH1_VDD: C148.1 IC30.1(A:E) IC30.4(B:E) IC31.4(R) IC31.8(V+) ; also sheet 2
CH2_GND: ZD11.A ; also sheet 1,2
EXT_TRIG: R155.1 ; also sheet 2
GND [gnd]: C150.1 C151.2 C152.1 C153.1 D28.1(A1) IC32.4(P:VSS) IC33.3(GND) IC33.4(PFI) IC34.3(B:VSS) OK3.3(EMIT) Q29.2(S) Q30.2(S) R149.2 R150.2 SW2.1 SW2.2 SW2.5(5-GND) X12.1 X12.1.1 ZD12.A ; also sheet 1,2,3,5
N$136: C149.2 IC31.2(TR) IC31.6(THR) R148.2
N$137: IC30.6(A:C) IC31.7(DIS) R148.1
N$138: OK3.1(A) R146.2
N$139: D28.3(C1A2) R153.2 R154.2
N$140: IC34.2(A:I) R154.1
N$141: IC34.4(A:O) R155.2
N$142: R153.1 X12.2 X12.2.1
N$144: D28.2(C2) R151.1 ZD12.C
N$148: D29.C R151.2
N$149: D29.A FB8.P$2
N$151: IC33.6(WDI) R152.1
N$152: IC32.3(B:O) Q29.1(G) R149.1
N$154: IC32.7(A:O) Q30.1(G) R150.1
NTC_IN: IC30.2(A:B) IC30.3(B:C) IC30.5(B:B) X12.7 X12.7.1
PWR_DIRECT: Q29.3(D) ; also sheet 2
PWR_SSTART: Q30.3(D) ; also sheet 2
PWRDIR: IC32.6(B:I1) ; also sheet 2
PWRSS: IC32.1(A:I0) ; also sheet 2
TEMP_FREQ1: IC31.3(Q) R146.1
WATCHDOG: R152.2 ; also sheet 2
Unconnected: IC31.5(CV) IC33.5(!PFO) IC33.8(!WDO)

### Notes on the sheet
- Remote programming inputs | Channel 1 V/F converter for battery NTC (optional)
- Power-on reset generator and power control
- Ch#1 NTC
- External trigger protection and level shifter/buffer
- Input level: +2.5 ... 5.5 V
- LED CC/CV indicators, Reset control,
- Optional Ethernet module connector, External trigger,
- V/F converter for battery NTC (optional), Encoder (optional)
- Licensed under the TAPR Open Hardware License (www.tapr.org/OHL)
- More info at http://www.envox.hr/eez
- Repository: https://github.com/eez-open

## Sheet 5 of 5
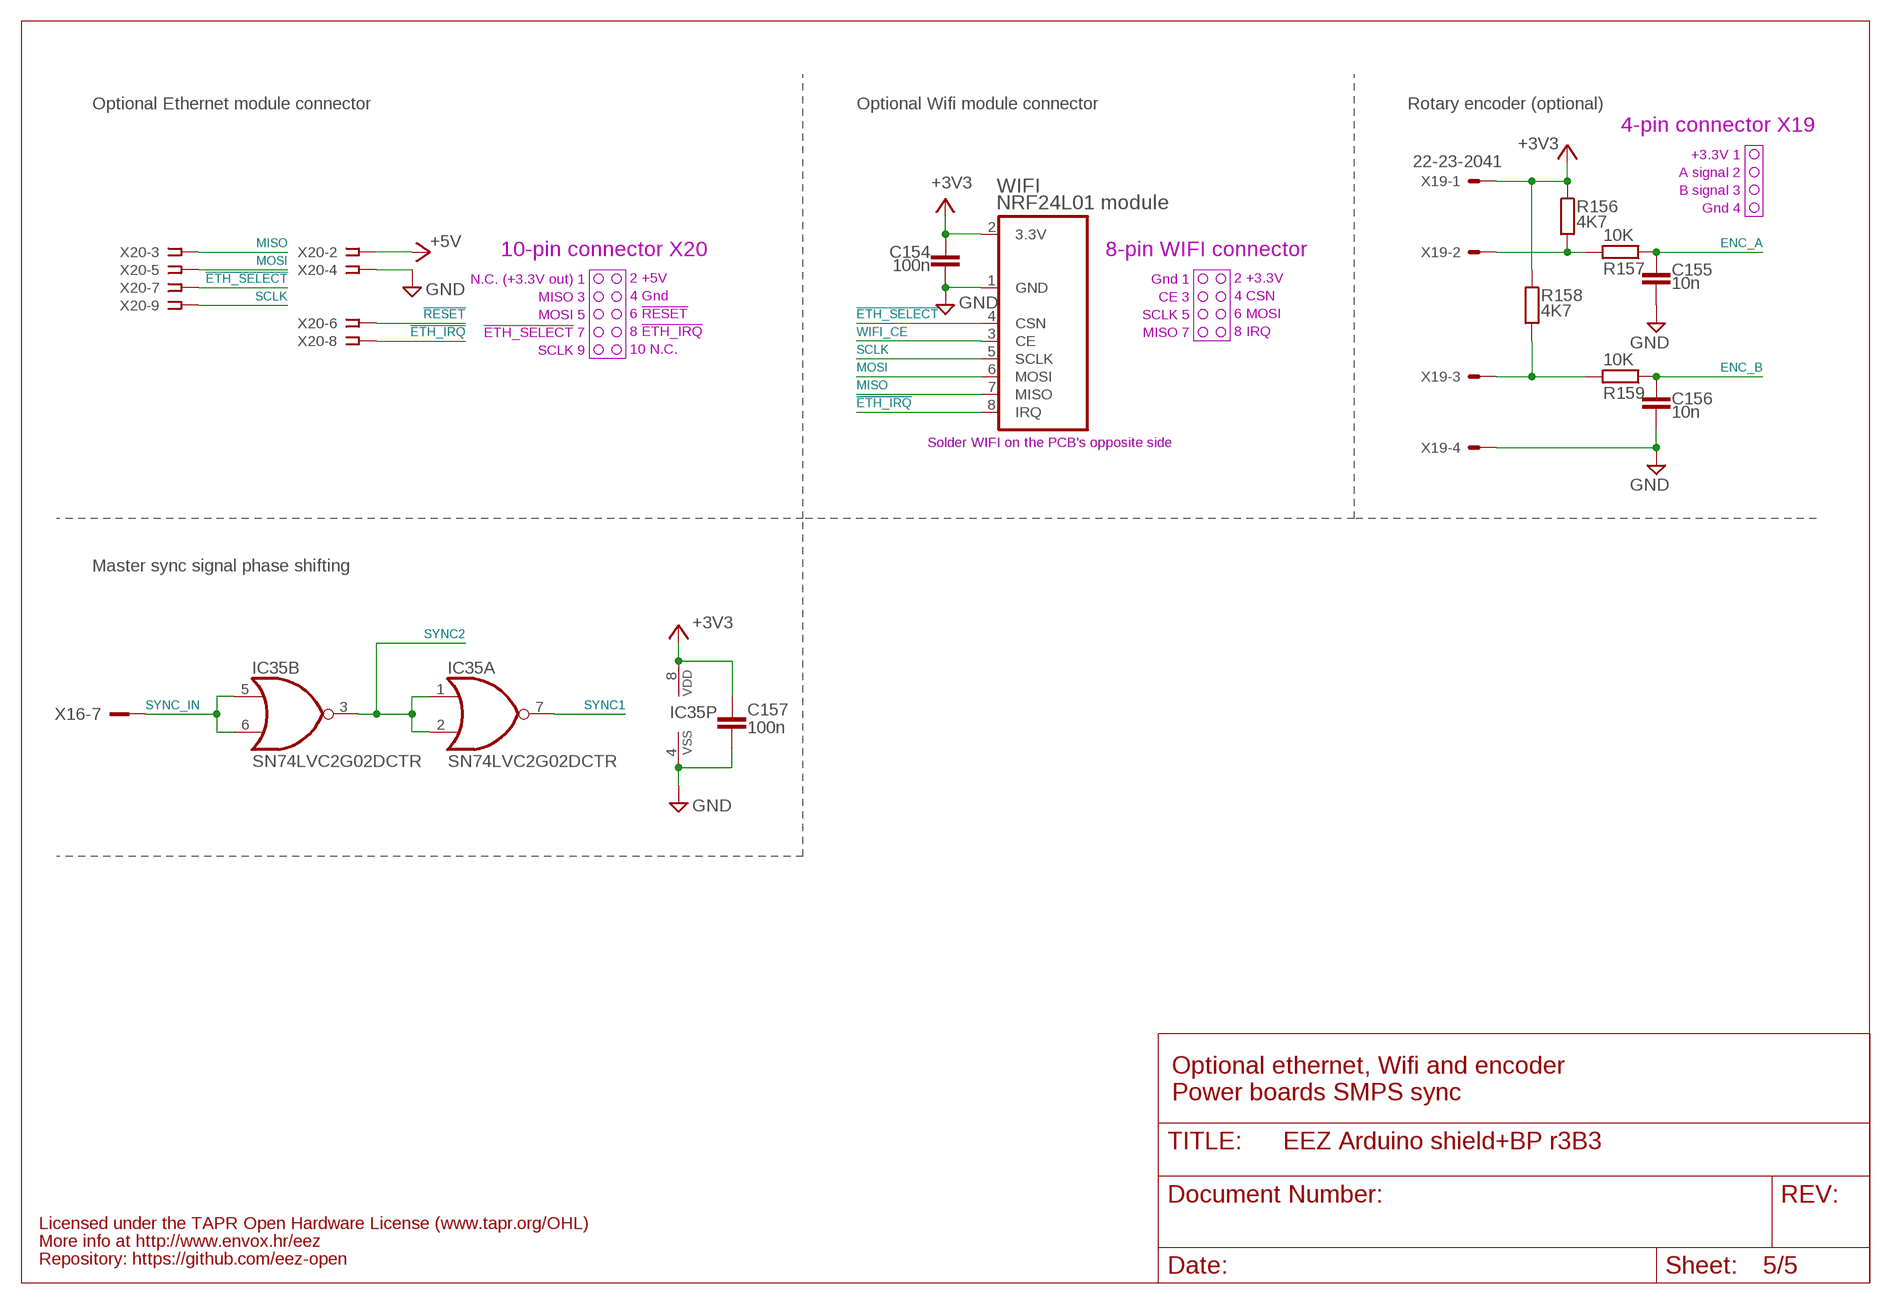
[diagram p4: schematic, sheet 5]

### Parts
C154  100n  C-EUC0603  [C0603]
C155  10n  C-EUC0805  [C0805]
C156  10n  C-EUC0805  [C0805]
C157  100n  C-EUC0603  [C0603]
IC35  SN74LVC2G02DCTR  [SOP65P400X130-8N]
R156  4K7  R-EU_R0805  [R0805]
R157  10K  R-EU_R0805  [R0805]
R158  4K7  R-EU_R0805  [R0805]
R159  10K  R-EU_R0805  [R0805]
WIFI  NRF24L01 module  MOD-NRF24L01MIRROR  [MOD-NRF24L01_MIRROR]
X19  22-23-2041  [22-23-2041]
X20  SSW-105-02-S-D  [SSW-105-02-S-D]

### Nets
!ETH_IRQ: WIFI.8(IRQ) X20.8 ; also sheet 2,3
!ETH_SELECT: WIFI.4(CSN) X20.7 ; also sheet 2,3
!RESET: X20.6 ; also sheet 2,3,4
+3V3: C154.1 C157.1 IC35.8(P:VDD) R156.1 R158.1 WIFI.2(3.3V) X19.1 ; also sheet 1,2,3,4
+5V: X20.2 ; also sheet 1,2,3,4
ENC_A: C155.2 R157.1 ; also sheet 2
ENC_B: C156.1 R159.1 ; also sheet 2
GND [gnd]: C154.2 C155.1 C156.2 C157.2 IC35.4(P:VSS) WIFI.1(GND) X19.4 X20.4 ; also sheet 1,2,3,4
MISO: WIFI.7(MISO) X20.3 ; also sheet 2,3
MOSI: WIFI.6(MOSI) X20.5 ; also sheet 1,2,3
N$157: R156.2 R157.2 X19.2
N$159: R158.2 R159.2 X19.3
SCLK: WIFI.5(SCLK) X20.9 ; also sheet 1,2,3
SYNC1: IC35.7(A:O) ; also sheet 2
SYNC2: IC35.1(A:I0) IC35.2(A:I1) IC35.3(B:O) ; also sheet 2
SYNC_IN: IC35.5(B:I0) IC35.6(B:I1) X16.7
WIFI_CE: WIFI.3(CE) ; also sheet 2
Unconnected: X20.1 X20.10

### Notes on the sheet
- Optional Ethernet module connector | Optional Wifi module connector | Rotary encoder (optional)
- 4-pin connector X19
- +3.3V 1
- A signal 2
- B signal 3
- Gnd 4
- 10-pin connector X20 | 8-pin WIFI connector
- N.C. (+3.3V out) 1 | Gnd 1
- 2 +5V | 2 +3.3V
- MISO 3 | CE 3
- 4 Gnd | 4 CSN
- MOSI 5 | SCLK 5
- 6 !RESET | 6 MOSI
- !ETH_SELECT! 7 | MISO 7
- 8 !ETH_IRQ | 8 IRQ
- SCLK 9
- 10 N.C.
- Solder WIFI on the PCB's opposite side
- Master sync signal phase shifting
- Optional ethernet, Wifi and encoder
- Power boards SMPS sync
- Licensed under the TAPR Open Hardware License (www.tapr.org/OHL)
- More info at http://www.envox.hr/eez
- Repository: https://github.com/eez-open

## Library data of the parts
C105 C106 C108-C111 C113-C119 C122-C127 C129-C144 C147-C157 = rcl:C-EU: CAPACITOR, European symbol
C107 C112 C120 C121 = MyLib6:ECAP
C128 = EEZ_Lib1:SUPER_CAP: Electric Double Layer Supercapacitors, Type EDL Vertical - Manufacturer Part No: EDLSG105V5R5C Farnell: 2113011 Horizontal - Manufacturer Part No: EDLSG105H5R5C Farnell: 1364209, 9697497
C145 C146 = EEZ_Lib1:ECAP
D22-D25 D27 = diode:DIODE-: DIODE
D26 = MyLib6:DIODE
D28 = diode:BAT54S: Schottky Diodes Pin connection corrected 2011-05-04 Source: Fairchild .. BAT54.pdf
D29 = EEZ_Lib1:SCHOTTKY
FB8 = EEZ_Lib1:FERRITE_BEAD: FAIR-RITE - 2506033007Y3 - FERRITE BEAD, 0.04OHM, 3A, 0603 Farnell: 2112873
IC21 = MyLib6:TLC5925IDBQR: CONSTANT-CURRENT LED SINK DRIVER; MPN: TLC5925IDBQR; OC_FARNELL: 1694438; OC_NEWARK: 46P3784; PACKAGE: SOP-24; SUPPLIER: Texas Instruments
IC22 IC26 = EEZ_Lib1:SI8641: Low power 4-ch digital isolator (3+1) Farnell: 2423288
IC23 IC24 = EEZ_Lib1:SI8651: Low power 5-ch digital isolator (4+1); FARNELL: 2423323
IC25 = v-reg:LD117A?*: Low drop fixed and adjustable positive voltage regulators 1 A Source: http://www.st.com/stonline/products/literature/ds/7194/ld1117axx.pdf
IC27 = MyLib6:PCA21125: SPI-bus Real-Time Clock and calendar Farnell: 2400445
IC28 = MyLib6:AT25XXX: SPI Serial EEPROM, Supports SPI Modes 0 (0,0) and 3 (1,1) Atmel AT25128 128K (16 384 x 8) Farnell: 2345601 Atmel AT25256 256K (32 768 x 8) Farnell: 1841577 Atmel AT25512 512K (65 536 x 8) Farnell: 2345608
IC29 = EEZ_Lib1:W5500: The W5500 chip is a Hardwired TCP/IP embedded Ethernet controller that enables easier internet connection for embedded systems using SPI (Serial Peripheral Interface). Case TQFP48; TME: W5500
IC30 = MyLib6:BC857BS: PNP general purpose dual transistor
IC31 = MyLib6:LM555
IC32 = EEZ_Lib1:SN74LVC2G08DCTR: DUAL 2-INPUT POSITIVE-AND GATE; MPN: SN74LVC2G08DCTR; OC_FARNELL: 1470871; OC_NEWARK: 68K1120; PACKAGE: SSOP-8; SUPPLIER: Texas Instruments
IC33 = EEZ_Lib1:TPS3705XX: Processor supervisory circuit with power-fail; FARNELL: 2296066
IC34 = EEZ_Lib1:SN74LV1T34: Single Power Supply Single Buffer GATE CMOS Logic Level Shifter; FARNELL: 2499914
IC35 = EEZ_Lib1:SN74LVC2G02DCTR: NOR Gate, LVC Family, 2 Input, 32 mA, 1.65V to 5.5V, SSOP-8
J1-J5 = EEZ_Lib1:BINDING_POST
JP3 = jumper:JP1E: JUMPER
JP4-JP7 = jump-0r-smd:0R-JUMP: SMD 0R 0805 Jumper
K_PAR K_SER = EEZ_Lib1:RELAY_RT314012
K_S1 K_S2 = relay:G6K: Low Signal Relay oeiwcsnts1.omron.com/.. D20G6K0100.pdf; MF: OMRON COMPONENTS USA; MPN: G6K-2F DC24; OC_FARNELL: 1690427; OC_NEWARK: 36K7467
LCD1 = EEZ_Lib1:LCD_TFT_320QVT: 3.2" 320x240 TFT Module Display Touch Panel with PCB 262K Colors IC SSD1289
LED_CC1 LED_CC2 LED_CV1 LED_CV2 LED_O1 LED_O2 LED_PROG1 LED_PROG2 LED_PWR LED_S1 LED_S2 LED_SP = EEZ_Lib1:LED
MCU = EEZ_Lib1:ARDUINO_MEGA+ICSP
OK3 = EEZ_Lib1:HCPL-181: Phototransistor Optocoupler SMD Mini-Flat Type
Q23-Q26 Q28 = MyLib6:IRLML2246TRPBF: HEXFET Power MOSFET (-20V, -2.6A); MPN: IRLML2246TRPBF; OC_FARNELL: 1888166; OC_NEWARK: 40T7450; PACKAGE: SOT-3; SUPPLIER: International Rectifier; TME: IRLML2246TRPBF
Q27 Q29 Q30 = MyLib6:2N7002: N-CHANNEL ENHANCEMENT MODE FIELD EFFECT TRANSISTOR; MPN: 2N7002-7-F; OC_FARNELL: 1713823; OC_NEWARK: 25R5679; PACKAGE: SOT-23-3; SUPPLIER: DIODES INC.
R122-R152 R154-R159 = rcl:R-EU_: RESISTOR, European symbol
R153 = resistor:R-EU_: RESISTOR, European symbol
RN1 RN2 = EEZ_Lib1:R_ARRAY4: 1206 four resistor array
SG1 = MyLib6:BUZZER
SH3 = EEZ_Lib1:SHORT
SW1 = switch:M9040P: TOGGLE SWITCH Marquardt
SW2 = EEZ_Lib1:TACT_SW
TP3 TP4 = EEZ_Lib1:TEST_POINT: Test point for oscilloscope probe
U$15 U$16 = EEZ_Lib1:FIDUCIAL: Fiducial mark for pick and place automation
WIFI = EEZ_Lib1:MOD-NRF24L01: Nordic nRF24L01, highly integrated, ultra low power (ULP) 2Mbps RF transceiver for the 2.4GHz
X12 = EEZ_Lib1:MC000006: Wire-To-Board Terminal Block, 8, 150 V, 6 A, 26 AWG, 20 AWG No. of Positions:8; Rated Voltage:150V; Rated Current:6A; FARNELL: 2007972
X13 X15 = EEZ_Lib1:TSW-113-07-F-D: Samtec TSW-110-07-F-D Header, 2.54MM, THT, 26-way; FARNELL: 2025182
X14 = EEZ_Lib1:MC000005: Wire-To-Board Terminal Block, 6, 150 V, 6 A, 26 AWG, 20 AWG No. of Positions:6; Rated Voltage:150V; Rated Current:6A
X16 = EEZ_Lib1:IDC-10PIN: 10-pin IDC socket male, straight; TME: T821-1-10-S1
X17 = con-molex:22-23-2021: .100" (2.54mm) Center Header - 2 Pin; MF: MOLEX; MPN: 22-23-2021; OC_FARNELL: 1462926; OC_NEWARK: 25C3832
X18 = con-samtec:SSW-108-02-S-S: THROUGH-HOLE .025" SQ POST SOCKET Source: Samtec SSW.pdf; MPN: SSW-108-02-S-S; OC_FARNELL: unknown; OC_NEWARK: 11P9448
X19 = con-molex:22-23-2041: .100" (2.54mm) Center Header - 4 Pin; MF: MOLEX; MPN: 22-23-2041; OC_FARNELL: 1462920; OC_NEWARK: 38C0355
X20 = con-samtec:SSW-105-02-S-D: THROUGH-HOLE .025" SQ POST SOCKET Source: Samtec SSW.pdf; MPN: SSW-105-02-S-D; OC_FARNELL: unknown; OC_NEWARK: 11P9398
Y1 Y2 = MyLib6:XTAL
ZD8-ZD11 = EEZ_Lib1:PSMAXX: Transient Voltage Suppressor, TVS, P4SMA Series, Unidirectional
ZD12 = EEZ_Lib1:ZENER-DIODE

## Net classes
0 default: width 0.254 mm, drill 0.584 mm, clearance 0.254 mm
1 dgnd: width 0.254 mm, drill 0.584 mm, clearance 0.254 mm
2 gnd: width 0.254 mm, drill 0.584 mm, clearance 0.254 mm